# Altium project Peak Detector - Multi channel.PrjPcb
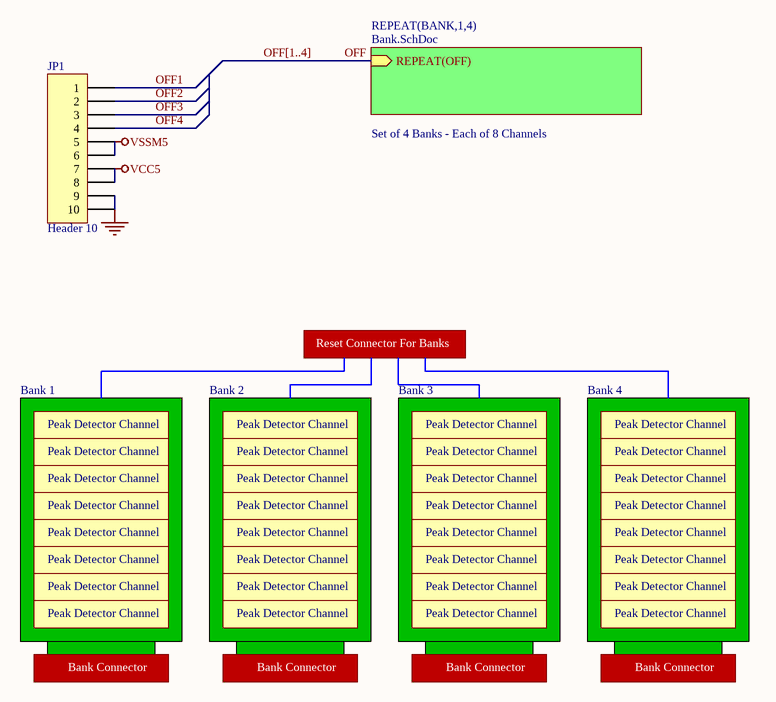
[diagram p0: Peak Detector.SchDoc]
3 sheets, 549 parts. Net scope: hierarchical (ports join the sheet entries above them; power ports are global).
Board file: Peak Detector With Banking.PcbDoc
Sheets:
  Peak Detector.SchDoc
    BANK1 = Bank.SchDoc
      PD1 = Peak Detector - channel.SchDoc
      PD2 = Peak Detector - channel.SchDoc
      PD3 = Peak Detector - channel.SchDoc
      PD4 = Peak Detector - channel.SchDoc
      PD5 = Peak Detector - channel.SchDoc
      PD6 = Peak Detector - channel.SchDoc
      PD7 = Peak Detector - channel.SchDoc
      PD8 = Peak Detector - channel.SchDoc
    BANK2 = Bank.SchDoc
      PD1 = Peak Detector - channel.SchDoc
      PD2 = Peak Detector - channel.SchDoc
      PD3 = Peak Detector - channel.SchDoc
      PD4 = Peak Detector - channel.SchDoc
      PD5 = Peak Detector - channel.SchDoc
      PD6 = Peak Detector - channel.SchDoc
      PD7 = Peak Detector - channel.SchDoc
      PD8 = Peak Detector - channel.SchDoc
    BANK3 = Bank.SchDoc
      PD1 = Peak Detector - channel.SchDoc
      PD2 = Peak Detector - channel.SchDoc
      PD3 = Peak Detector - channel.SchDoc
      PD4 = Peak Detector - channel.SchDoc
      PD5 = Peak Detector - channel.SchDoc
      PD6 = Peak Detector - channel.SchDoc
      PD7 = Peak Detector - channel.SchDoc
      PD8 = Peak Detector - channel.SchDoc
    BANK4 = Bank.SchDoc
      PD1 = Peak Detector - channel.SchDoc
      PD2 = Peak Detector - channel.SchDoc
      PD3 = Peak Detector - channel.SchDoc
      PD4 = Peak Detector - channel.SchDoc
      PD5 = Peak Detector - channel.SchDoc
      PD6 = Peak Detector - channel.SchDoc
      PD7 = Peak Detector - channel.SchDoc
      PD8 = Peak Detector - channel.SchDoc

## Sheet Peak Detector.SchDoc
size A; Organization: Altium Limited; Address1: L3, 12a Rodborough Rd; Address2: Frenchs Forest; Address3: NSW; Address4: Australia 2086; DocumentNumber: 2; SheetNumber: 2; SheetTotal: 3

### Parts
JP1  Header 10  [HDR1X10]

### Sub-sheets
REPEAT(BANK,1,4) = Bank.SchDoc: REPEAT(OFF) (in)  | Description: Set of 4 Banks - Each of 8 Channels

### Nets
GND: JP1.9 JP1.10
VCC5: JP1.7 JP1.8
VSSM5: JP1.5 JP1.6
OFF: sheet REPEAT(BANK,1,4)/REPEAT(OFF)
OFF1: JP1.1
OFF2: JP1.2
OFF3: JP1.3
OFF4: JP1.4

### Buses and harness runs
bus OFF[1..4]

### Notes on the sheet
- Reset Connector For Banks
- Bank 1
- Peak Detector Channel
- Bank 2
- Bank 3
- Bank 4
- Bank Connector
- Title
- Size:
- Date:
- A
- Number:
- Time:
- Revision:
- Sheet
- of
- File:

### Library data of the parts
JP1 = Header 10: Header, 10-Pin; Manufacturer: Generic Components; Class: Connector

## Sheet Bank.SchDoc
size A; Organization: Altium Limited; Address1: L3, 12a Rodborough Rd; Address2: Frenchs Forest; Address3: NSW; Address4: Australia 2086; DocumentNumber: 3; SheetNumber: 3; SheetTotal: 3
Used 4 times, as channels BANK1, BANK2, BANK3, BANK4. Parts and nets are listed once, with the designators drawn on the sheet.
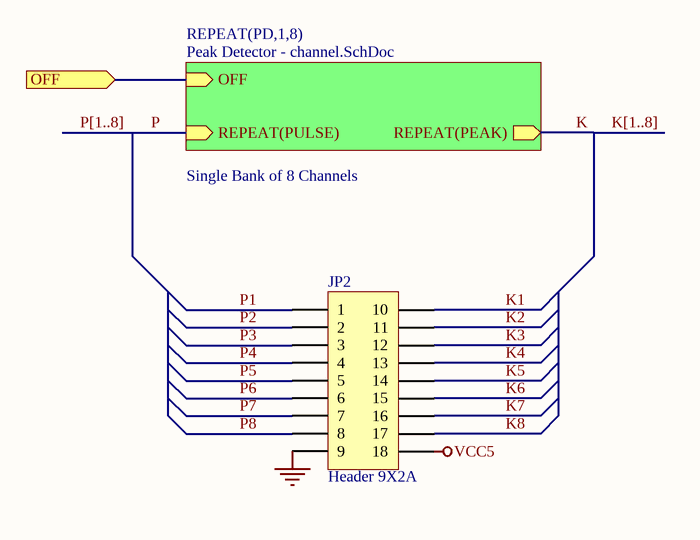
[diagram p1: Bank.SchDoc]

### Parts
JP2  Header 9X2A  [FFC/SM0.5-2H18A]

### Sub-sheets
REPEAT(PD,1,8) = Peak Detector - channel.SchDoc: REPEAT(PULSE) (in), REPEAT(PEAK) (out), OFF  | Description: Single Bank of 8 Channels

### Ports
OFF

### Nets
GND: JP2.9
VCC5: JP2.18
K: sheet REPEAT(PD,1,8)/REPEAT(PEAK)
K1: JP2.10
K2: JP2.11
K3: JP2.12
K4: JP2.13
K5: JP2.14
K6: JP2.15
K7: JP2.16
K8: JP2.17
OFF: port OFF, sheet REPEAT(PD,1,8)/OFF
P: sheet REPEAT(PD,1,8)/REPEAT(PULSE)
P1: JP2.1
P2: JP2.2
P3: JP2.3
P4: JP2.4
P5: JP2.5
P6: JP2.6
P7: JP2.7
P8: JP2.8

### Channels
BANK1: designators end in _BANK1; ports OFF=OFF1
BANK2: designators end in _BANK2; ports OFF=OFF2
BANK3: designators end in _BANK3; ports OFF=OFF3
BANK4: designators end in _BANK4; ports OFF=OFF4

### Buses and harness runs
bus K[1..8]
bus P[1..8]

### Notes on the sheet
- Title
- Size:
- Date:
- A
- Number:
- Time:
- Revision:
- Sheet
- of
- File:

### Library data of the parts
JP2 = Header 9X2A: Header, 9-Pin, Dual row; Manufacturer: Generic Components; Class: Connector

## Sheet Peak Detector - channel.SchDoc
size A; Organization: Altium Limited; Address1: L3, 12a Rodborough Rd; Address2: Frenchs Forest; Address3: NSW; Address4: Australia 2086; DocumentNumber: 1; SheetNumber: 1; SheetTotal: 3
Used 32 times, as channels BANK1/PD1, BANK1/PD2, BANK1/PD3, BANK1/PD4, BANK1/PD5, BANK1/PD6, BANK1/PD7, BANK1/PD8, BANK2/PD1, BANK2/PD2, BANK2/PD3, BANK2/PD4, BANK2/PD5, BANK2/PD6, BANK2/PD7, BANK2/PD8, BANK3/PD1, BANK3/PD2, BANK3/PD3, BANK3/PD4, BANK3/PD5, BANK3/PD6, BANK3/PD7, BANK3/PD8, BANK4/PD1, BANK4/PD2, BANK4/PD3, BANK4/PD4, BANK4/PD5, BANK4/PD6, BANK4/PD7, BANK4/PD8. Parts and nets are listed once, with the designators drawn on the sheet.
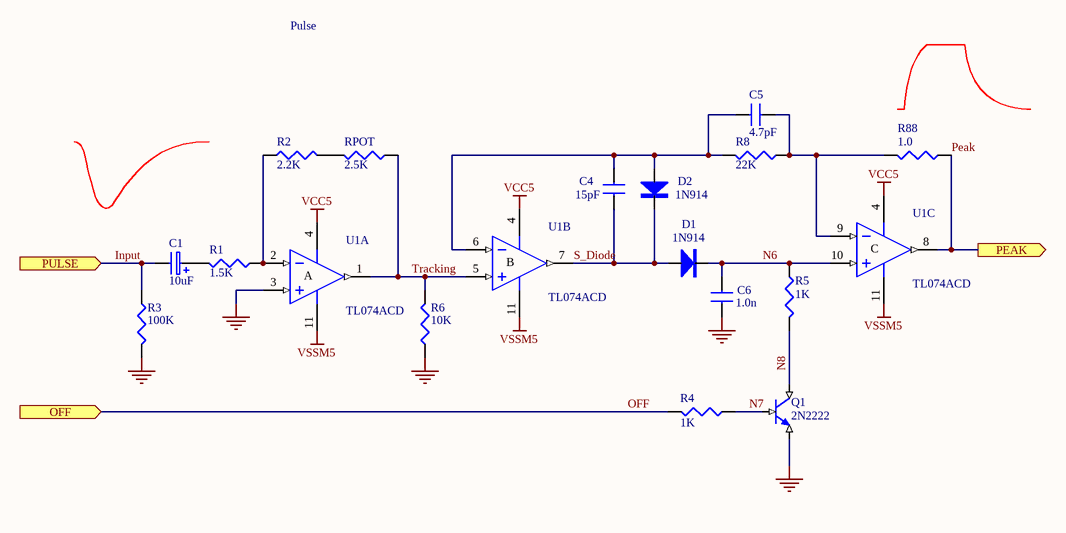
[diagram p2: Peak Detector - channel.SchDoc]

### Parts
C1  10uF  [1206]
C4  15pF  [0805]
C5  4.7pF  [0805]
C6  1.0n  [0805]
D1  1N914  [3216]
D2  1N914  [3216]
Q1  2N2222  [SO-G3/D4.1]
R1  1.5K  [0603]
R2  2.2K  [0603]
R3  100K  [0603]
R4  value 1K  [0603]  (hidden comment: 10K)
R5  1K  [0603]
R6  10K  [0603]
R8  22K  [0603]
R88  1.0  [0603]
RPOT  2.5K  [0603]
U1  TL074ACD  [SO-G14/G3]  (parts A,B,C of 4)

### Ports
OFF (in), PEAK (out), PULSE (in)

### Nets
GND: C6.1 Q1.3(E) R3.1(TOP) R6.2(BOT) U1.3(IN+)
VCC5: U1.4(V+)
VSSM5: U1.11(V-)
Input: C1.2 R3.2(BOT) ; port PULSE
N6: C6.2 D1.2(K) R5.1(TOP) U1.10(IN+)
N7: Q1.2(B) R4.2(BOT)
N8: Q1.1(C) R5.2(BOT)
OFF: R4.1(TOP) ; port OFF
Peak: R88.2(BOT) U1.8(OUT) ; port PEAK
S_Diode: C4.2 D1.1(A) D2.2(K) U1.7(OUT)
Tracking: R6.1(TOP) RPOT.2(BOT) U1.1(OUT) U1.5(IN+)
NetC1_1: C1.1 R1.1(TOP)
NetC4_1: C4.1 C5.1 D2.1(A) R8.1(TOP) U1.6(IN-)
NetC5_2: C5.2 R8.2(BOT) R88.1(TOP) U1.9(IN-)
NetR1_2: R1.2(BOT) R2.2(BOT) U1.2(IN-)
NetR2_1: R2.1(TOP) RPOT.1(TOP)

### Channels
BANK1/PD1: designators end in _PD1; ports OFF=OFF1 PEAK=K1_BANK1 PULSE=P1_BANK1
BANK1/PD2: designators end in _PD2; ports OFF=OFF1 PEAK=K2_BANK1 PULSE=P2_BANK1
BANK1/PD3: designators end in _PD3; ports OFF=OFF1 PEAK=K3_BANK1 PULSE=P3_BANK1
BANK1/PD4: designators end in _PD4; ports OFF=OFF1 PEAK=K4_BANK1 PULSE=P4_BANK1
BANK1/PD5: designators end in _PD5; ports OFF=OFF1 PEAK=K5_BANK1 PULSE=P5_BANK1
BANK1/PD6: designators end in _PD6; ports OFF=OFF1 PEAK=K6_BANK1 PULSE=P6_BANK1
BANK1/PD7: designators end in _PD7; ports OFF=OFF1 PEAK=K7_BANK1 PULSE=P7_BANK1
BANK1/PD8: designators end in _PD8; ports OFF=OFF1 PEAK=K8_BANK1 PULSE=P8_BANK1
BANK2/PD1: designators end in _PD9; ports OFF=OFF2 PEAK=K1_BANK2 PULSE=P1_BANK2
BANK2/PD2: designators end in _PD10; ports OFF=OFF2 PEAK=K2_BANK2 PULSE=P2_BANK2
BANK2/PD3: designators end in _PD11; ports OFF=OFF2 PEAK=K3_BANK2 PULSE=P3_BANK2
BANK2/PD4: designators end in _PD12; ports OFF=OFF2 PEAK=K4_BANK2 PULSE=P4_BANK2
BANK2/PD5: designators end in _PD13; ports OFF=OFF2 PEAK=K5_BANK2 PULSE=P5_BANK2
BANK2/PD6: designators end in _PD14; ports OFF=OFF2 PEAK=K6_BANK2 PULSE=P6_BANK2
BANK2/PD7: designators end in _PD15; ports OFF=OFF2 PEAK=K7_BANK2 PULSE=P7_BANK2
BANK2/PD8: designators end in _PD16; ports OFF=OFF2 PEAK=K8_BANK2 PULSE=P8_BANK2
BANK3/PD1: designators end in _PD17; ports OFF=OFF3 PEAK=K1_BANK3 PULSE=P1_BANK3
BANK3/PD2: designators end in _PD18; ports OFF=OFF3 PEAK=K2_BANK3 PULSE=P2_BANK3
BANK3/PD3: designators end in _PD19; ports OFF=OFF3 PEAK=K3_BANK3 PULSE=P3_BANK3
BANK3/PD4: designators end in _PD20; ports OFF=OFF3 PEAK=K4_BANK3 PULSE=P4_BANK3
BANK3/PD5: designators end in _PD21; ports OFF=OFF3 PEAK=K5_BANK3 PULSE=P5_BANK3
BANK3/PD6: designators end in _PD22; ports OFF=OFF3 PEAK=K6_BANK3 PULSE=P6_BANK3
BANK3/PD7: designators end in _PD23; ports OFF=OFF3 PEAK=K7_BANK3 PULSE=P7_BANK3
BANK3/PD8: designators end in _PD24; ports OFF=OFF3 PEAK=K8_BANK3 PULSE=P8_BANK3
BANK4/PD1: designators end in _PD25; ports OFF=OFF4 PEAK=K1_BANK4 PULSE=P1_BANK4
BANK4/PD2: designators end in _PD26; ports OFF=OFF4 PEAK=K2_BANK4 PULSE=P2_BANK4
BANK4/PD3: designators end in _PD27; ports OFF=OFF4 PEAK=K3_BANK4 PULSE=P3_BANK4
BANK4/PD4: designators end in _PD28; ports OFF=OFF4 PEAK=K4_BANK4 PULSE=P4_BANK4
BANK4/PD5: designators end in _PD29; ports OFF=OFF4 PEAK=K5_BANK4 PULSE=P5_BANK4
BANK4/PD6: designators end in _PD30; ports OFF=OFF4 PEAK=K6_BANK4 PULSE=P6_BANK4
BANK4/PD7: designators end in _PD31; ports OFF=OFF4 PEAK=K7_BANK4 PULSE=P7_BANK4
BANK4/PD8: designators end in _PD32; ports OFF=OFF4 PEAK=K8_BANK4 PULSE=P8_BANK4

### Notes on the sheet
- Pulse
- Title
- Size:
- Date:
- A
- Number:
- Time:
- Revision:
- Sheet
- of
- File:
- (in symbol TL074ACD, part A) A
- (in symbol TL074ACD, part B) B
- (in symbol TL074ACD, part C) C

### Library data of the parts
C1 = CAP3: Capacitor; Value: 10uF
C4-C6 = CAP: Capacitor
  C4: Value: 15pF
  C5: Value: 4.7pF
  C6: Value: 1.0n
D1 D2 = 1N914: Diode
Q1 = 2N2222: NPN BJT
R1-R6 R8 R88 RPOT = RES: Resistor
  R1: Value: 1.5K
  R2: Value: 2.2K
  R3: Value: 100K
  R5: Value: 1K
  R6: Value: 10K
  R8: Value: 22K
  R88: Value: 1.0
  RPOT: Value: 2.5K
U1 = TL074ACD: Low-Noise J-FET Quad Operational Amplifier; Text Field7: Published 24-Aug-2001

## Nets that join several sheets
GND: Peak Detector (JP1.9 JP1.10), BANK1 (JP2_BANK1.9), BANK1/PD1 (5 pins), BANK1/PD2 (5 pins), BANK1/PD3 (5 pins), BANK1/PD4 (5 pins), BANK1/PD5 (5 pins), BANK1/PD6 (5 pins), BANK1/PD7 (5 pins), BANK1/PD8 (5 pins), BANK2 (JP2_BANK2.9), BANK2/PD1 (5 pins), BANK2/PD2 (5 pins), BANK2/PD3 (5 pins), BANK2/PD4 (5 pins), BANK2/PD5 (5 pins), BANK2/PD6 (5 pins), BANK2/PD7 (5 pins), BANK2/PD8 (5 pins), BANK3 (JP2_BANK3.9), BANK3/PD1 (5 pins), BANK3/PD2 (5 pins), BANK3/PD3 (5 pins), BANK3/PD4 (5 pins), BANK3/PD5 (5 pins), BANK3/PD6 (5 pins), BANK3/PD7 (5 pins), BANK3/PD8 (5 pins), BANK4 (JP2_BANK4.9), BANK4/PD1 (5 pins), BANK4/PD2 (5 pins), BANK4/PD3 (5 pins), BANK4/PD4 (5 pins), BANK4/PD5 (5 pins), BANK4/PD6 (5 pins), BANK4/PD7 (5 pins), BANK4/PD8 (5 pins)
VCC5: Peak Detector (JP1.7 JP1.8), BANK1 (JP2_BANK1.18), BANK1/PD1 (U1_PD1.4), BANK1/PD2 (U1_PD2.4), BANK1/PD3 (U1_PD3.4), BANK1/PD4 (U1_PD4.4), BANK1/PD5 (U1_PD5.4), BANK1/PD6 (U1_PD6.4), BANK1/PD7 (U1_PD7.4), BANK1/PD8 (U1_PD8.4), BANK2 (JP2_BANK2.18), BANK2/PD1 (U1_PD9.4), BANK2/PD2 (U1_PD10.4), BANK2/PD3 (U1_PD11.4), BANK2/PD4 (U1_PD12.4), BANK2/PD5 (U1_PD13.4), BANK2/PD6 (U1_PD14.4), BANK2/PD7 (U1_PD15.4), BANK2/PD8 (U1_PD16.4), BANK3 (JP2_BANK3.18), BANK3/PD1 (U1_PD17.4), BANK3/PD2 (U1_PD18.4), BANK3/PD3 (U1_PD19.4), BANK3/PD4 (U1_PD20.4), BANK3/PD5 (U1_PD21.4), BANK3/PD6 (U1_PD22.4), BANK3/PD7 (U1_PD23.4), BANK3/PD8 (U1_PD24.4), BANK4 (JP2_BANK4.18), BANK4/PD1 (U1_PD25.4), BANK4/PD2 (U1_PD26.4), BANK4/PD3 (U1_PD27.4), BANK4/PD4 (U1_PD28.4), BANK4/PD5 (U1_PD29.4), BANK4/PD6 (U1_PD30.4), BANK4/PD7 (U1_PD31.4), BANK4/PD8 (U1_PD32.4)
VSSM5: Peak Detector (JP1.5 JP1.6), BANK1/PD1 (U1_PD1.11), BANK1/PD2 (U1_PD2.11), BANK1/PD3 (U1_PD3.11), BANK1/PD4 (U1_PD4.11), BANK1/PD5 (U1_PD5.11), BANK1/PD6 (U1_PD6.11), BANK1/PD7 (U1_PD7.11), BANK1/PD8 (U1_PD8.11), BANK2/PD1 (U1_PD9.11), BANK2/PD2 (U1_PD10.11), BANK2/PD3 (U1_PD11.11), BANK2/PD4 (U1_PD12.11), BANK2/PD5 (U1_PD13.11), BANK2/PD6 (U1_PD14.11), BANK2/PD7 (U1_PD15.11), BANK2/PD8 (U1_PD16.11), BANK3/PD1 (U1_PD17.11), BANK3/PD2 (U1_PD18.11), BANK3/PD3 (U1_PD19.11), BANK3/PD4 (U1_PD20.11), BANK3/PD5 (U1_PD21.11), BANK3/PD6 (U1_PD22.11), BANK3/PD7 (U1_PD23.11), BANK3/PD8 (U1_PD24.11), BANK4/PD1 (U1_PD25.11), BANK4/PD2 (U1_PD26.11), BANK4/PD3 (U1_PD27.11), BANK4/PD4 (U1_PD28.11), BANK4/PD5 (U1_PD29.11), BANK4/PD6 (U1_PD30.11), BANK4/PD7 (U1_PD31.11), BANK4/PD8 (U1_PD32.11)
K1_BANK1: BANK1 (JP2_BANK1.10), BANK1/PD1 (R88_PD1.2 U1_PD1.8)
K1_BANK2: BANK2 (JP2_BANK2.10), BANK2/PD1 (R88_PD9.2 U1_PD9.8)
K1_BANK3: BANK3 (JP2_BANK3.10), BANK3/PD1 (R88_PD17.2 U1_PD17.8)
K1_BANK4: BANK4 (JP2_BANK4.10), BANK4/PD1 (R88_PD25.2 U1_PD25.8)
K2_BANK1: BANK1 (JP2_BANK1.11), BANK1/PD2 (R88_PD2.2 U1_PD2.8)
K2_BANK2: BANK2 (JP2_BANK2.11), BANK2/PD2 (R88_PD10.2 U1_PD10.8)
K2_BANK3: BANK3 (JP2_BANK3.11), BANK3/PD2 (R88_PD18.2 U1_PD18.8)
K2_BANK4: BANK4 (JP2_BANK4.11), BANK4/PD2 (R88_PD26.2 U1_PD26.8)
K3_BANK1: BANK1 (JP2_BANK1.12), BANK1/PD3 (R88_PD3.2 U1_PD3.8)
K3_BANK2: BANK2 (JP2_BANK2.12), BANK2/PD3 (R88_PD11.2 U1_PD11.8)
K3_BANK3: BANK3 (JP2_BANK3.12), BANK3/PD3 (R88_PD19.2 U1_PD19.8)
K3_BANK4: BANK4 (JP2_BANK4.12), BANK4/PD3 (R88_PD27.2 U1_PD27.8)
K4_BANK1: BANK1 (JP2_BANK1.13), BANK1/PD4 (R88_PD4.2 U1_PD4.8)
K4_BANK2: BANK2 (JP2_BANK2.13), BANK2/PD4 (R88_PD12.2 U1_PD12.8)
K4_BANK3: BANK3 (JP2_BANK3.13), BANK3/PD4 (R88_PD20.2 U1_PD20.8)
K4_BANK4: BANK4 (JP2_BANK4.13), BANK4/PD4 (R88_PD28.2 U1_PD28.8)
K5_BANK1: BANK1 (JP2_BANK1.14), BANK1/PD5 (R88_PD5.2 U1_PD5.8)
K5_BANK2: BANK2 (JP2_BANK2.14), BANK2/PD5 (R88_PD13.2 U1_PD13.8)
K5_BANK3: BANK3 (JP2_BANK3.14), BANK3/PD5 (R88_PD21.2 U1_PD21.8)
K5_BANK4: BANK4 (JP2_BANK4.14), BANK4/PD5 (R88_PD29.2 U1_PD29.8)
K6_BANK1: BANK1 (JP2_BANK1.15), BANK1/PD6 (R88_PD6.2 U1_PD6.8)
K6_BANK2: BANK2 (JP2_BANK2.15), BANK2/PD6 (R88_PD14.2 U1_PD14.8)
K6_BANK3: BANK3 (JP2_BANK3.15), BANK3/PD6 (R88_PD22.2 U1_PD22.8)
K6_BANK4: BANK4 (JP2_BANK4.15), BANK4/PD6 (R88_PD30.2 U1_PD30.8)
K7_BANK1: BANK1 (JP2_BANK1.16), BANK1/PD7 (R88_PD7.2 U1_PD7.8)
K7_BANK2: BANK2 (JP2_BANK2.16), BANK2/PD7 (R88_PD15.2 U1_PD15.8)
K7_BANK3: BANK3 (JP2_BANK3.16), BANK3/PD7 (R88_PD23.2 U1_PD23.8)
K7_BANK4: BANK4 (JP2_BANK4.16), BANK4/PD7 (R88_PD31.2 U1_PD31.8)
K8_BANK1: BANK1 (JP2_BANK1.17), BANK1/PD8 (R88_PD8.2 U1_PD8.8)
K8_BANK2: BANK2 (JP2_BANK2.17), BANK2/PD8 (R88_PD16.2 U1_PD16.8)
K8_BANK3: BANK3 (JP2_BANK3.17), BANK3/PD8 (R88_PD24.2 U1_PD24.8)
K8_BANK4: BANK4 (JP2_BANK4.17), BANK4/PD8 (R88_PD32.2 U1_PD32.8)
OFF1: Peak Detector (JP1.1), BANK1/PD1 (R4_PD1.1), BANK1/PD2 (R4_PD2.1), BANK1/PD3 (R4_PD3.1), BANK1/PD4 (R4_PD4.1), BANK1/PD5 (R4_PD5.1), BANK1/PD6 (R4_PD6.1), BANK1/PD7 (R4_PD7.1), BANK1/PD8 (R4_PD8.1)
OFF2: Peak Detector (JP1.2), BANK2/PD1 (R4_PD9.1), BANK2/PD2 (R4_PD10.1), BANK2/PD3 (R4_PD11.1), BANK2/PD4 (R4_PD12.1), BANK2/PD5 (R4_PD13.1), BANK2/PD6 (R4_PD14.1), BANK2/PD7 (R4_PD15.1), BANK2/PD8 (R4_PD16.1)
OFF3: Peak Detector (JP1.3), BANK3/PD1 (R4_PD17.1), BANK3/PD2 (R4_PD18.1), BANK3/PD3 (R4_PD19.1), BANK3/PD4 (R4_PD20.1), BANK3/PD5 (R4_PD21.1), BANK3/PD6 (R4_PD22.1), BANK3/PD7 (R4_PD23.1), BANK3/PD8 (R4_PD24.1)
OFF4: Peak Detector (JP1.4), BANK4/PD1 (R4_PD25.1), BANK4/PD2 (R4_PD26.1), BANK4/PD3 (R4_PD27.1), BANK4/PD4 (R4_PD28.1), BANK4/PD5 (R4_PD29.1), BANK4/PD6 (R4_PD30.1), BANK4/PD7 (R4_PD31.1), BANK4/PD8 (R4_PD32.1)
P1_BANK1: BANK1 (JP2_BANK1.1), BANK1/PD1 (C1_PD1.2 R3_PD1.2)
P1_BANK2: BANK2 (JP2_BANK2.1), BANK2/PD1 (C1_PD9.2 R3_PD9.2)
P1_BANK3: BANK3 (JP2_BANK3.1), BANK3/PD1 (C1_PD17.2 R3_PD17.2)
P1_BANK4: BANK4 (JP2_BANK4.1), BANK4/PD1 (C1_PD25.2 R3_PD25.2)
P2_BANK1: BANK1 (JP2_BANK1.2), BANK1/PD2 (C1_PD2.2 R3_PD2.2)
P2_BANK2: BANK2 (JP2_BANK2.2), BANK2/PD2 (C1_PD10.2 R3_PD10.2)
P2_BANK3: BANK3 (JP2_BANK3.2), BANK3/PD2 (C1_PD18.2 R3_PD18.2)
P2_BANK4: BANK4 (JP2_BANK4.2), BANK4/PD2 (C1_PD26.2 R3_PD26.2)
P3_BANK1: BANK1 (JP2_BANK1.3), BANK1/PD3 (C1_PD3.2 R3_PD3.2)
P3_BANK2: BANK2 (JP2_BANK2.3), BANK2/PD3 (C1_PD11.2 R3_PD11.2)
P3_BANK3: BANK3 (JP2_BANK3.3), BANK3/PD3 (C1_PD19.2 R3_PD19.2)
P3_BANK4: BANK4 (JP2_BANK4.3), BANK4/PD3 (C1_PD27.2 R3_PD27.2)
P4_BANK1: BANK1 (JP2_BANK1.4), BANK1/PD4 (C1_PD4.2 R3_PD4.2)
P4_BANK2: BANK2 (JP2_BANK2.4), BANK2/PD4 (C1_PD12.2 R3_PD12.2)
P4_BANK3: BANK3 (JP2_BANK3.4), BANK3/PD4 (C1_PD20.2 R3_PD20.2)
P4_BANK4: BANK4 (JP2_BANK4.4), BANK4/PD4 (C1_PD28.2 R3_PD28.2)
P5_BANK1: BANK1 (JP2_BANK1.5), BANK1/PD5 (C1_PD5.2 R3_PD5.2)
P5_BANK2: BANK2 (JP2_BANK2.5), BANK2/PD5 (C1_PD13.2 R3_PD13.2)
P5_BANK3: BANK3 (JP2_BANK3.5), BANK3/PD5 (C1_PD21.2 R3_PD21.2)
P5_BANK4: BANK4 (JP2_BANK4.5), BANK4/PD5 (C1_PD29.2 R3_PD29.2)
P6_BANK1: BANK1 (JP2_BANK1.6), BANK1/PD6 (C1_PD6.2 R3_PD6.2)
P6_BANK2: BANK2 (JP2_BANK2.6), BANK2/PD6 (C1_PD14.2 R3_PD14.2)
P6_BANK3: BANK3 (JP2_BANK3.6), BANK3/PD6 (C1_PD22.2 R3_PD22.2)
P6_BANK4: BANK4 (JP2_BANK4.6), BANK4/PD6 (C1_PD30.2 R3_PD30.2)
P7_BANK1: BANK1 (JP2_BANK1.7), BANK1/PD7 (C1_PD7.2 R3_PD7.2)
P7_BANK2: BANK2 (JP2_BANK2.7), BANK2/PD7 (C1_PD15.2 R3_PD15.2)
P7_BANK3: BANK3 (JP2_BANK3.7), BANK3/PD7 (C1_PD23.2 R3_PD23.2)
P7_BANK4: BANK4 (JP2_BANK4.7), BANK4/PD7 (C1_PD31.2 R3_PD31.2)
P8_BANK1: BANK1 (JP2_BANK1.8), BANK1/PD8 (C1_PD8.2 R3_PD8.2)
P8_BANK2: BANK2 (JP2_BANK2.8), BANK2/PD8 (C1_PD16.2 R3_PD16.2)
P8_BANK3: BANK3 (JP2_BANK3.8), BANK3/PD8 (C1_PD24.2 R3_PD24.2)
P8_BANK4: BANK4 (JP2_BANK4.8), BANK4/PD8 (C1_PD32.2 R3_PD32.2)